# Altium schematic sheet JTAG.SchDoc
size A3
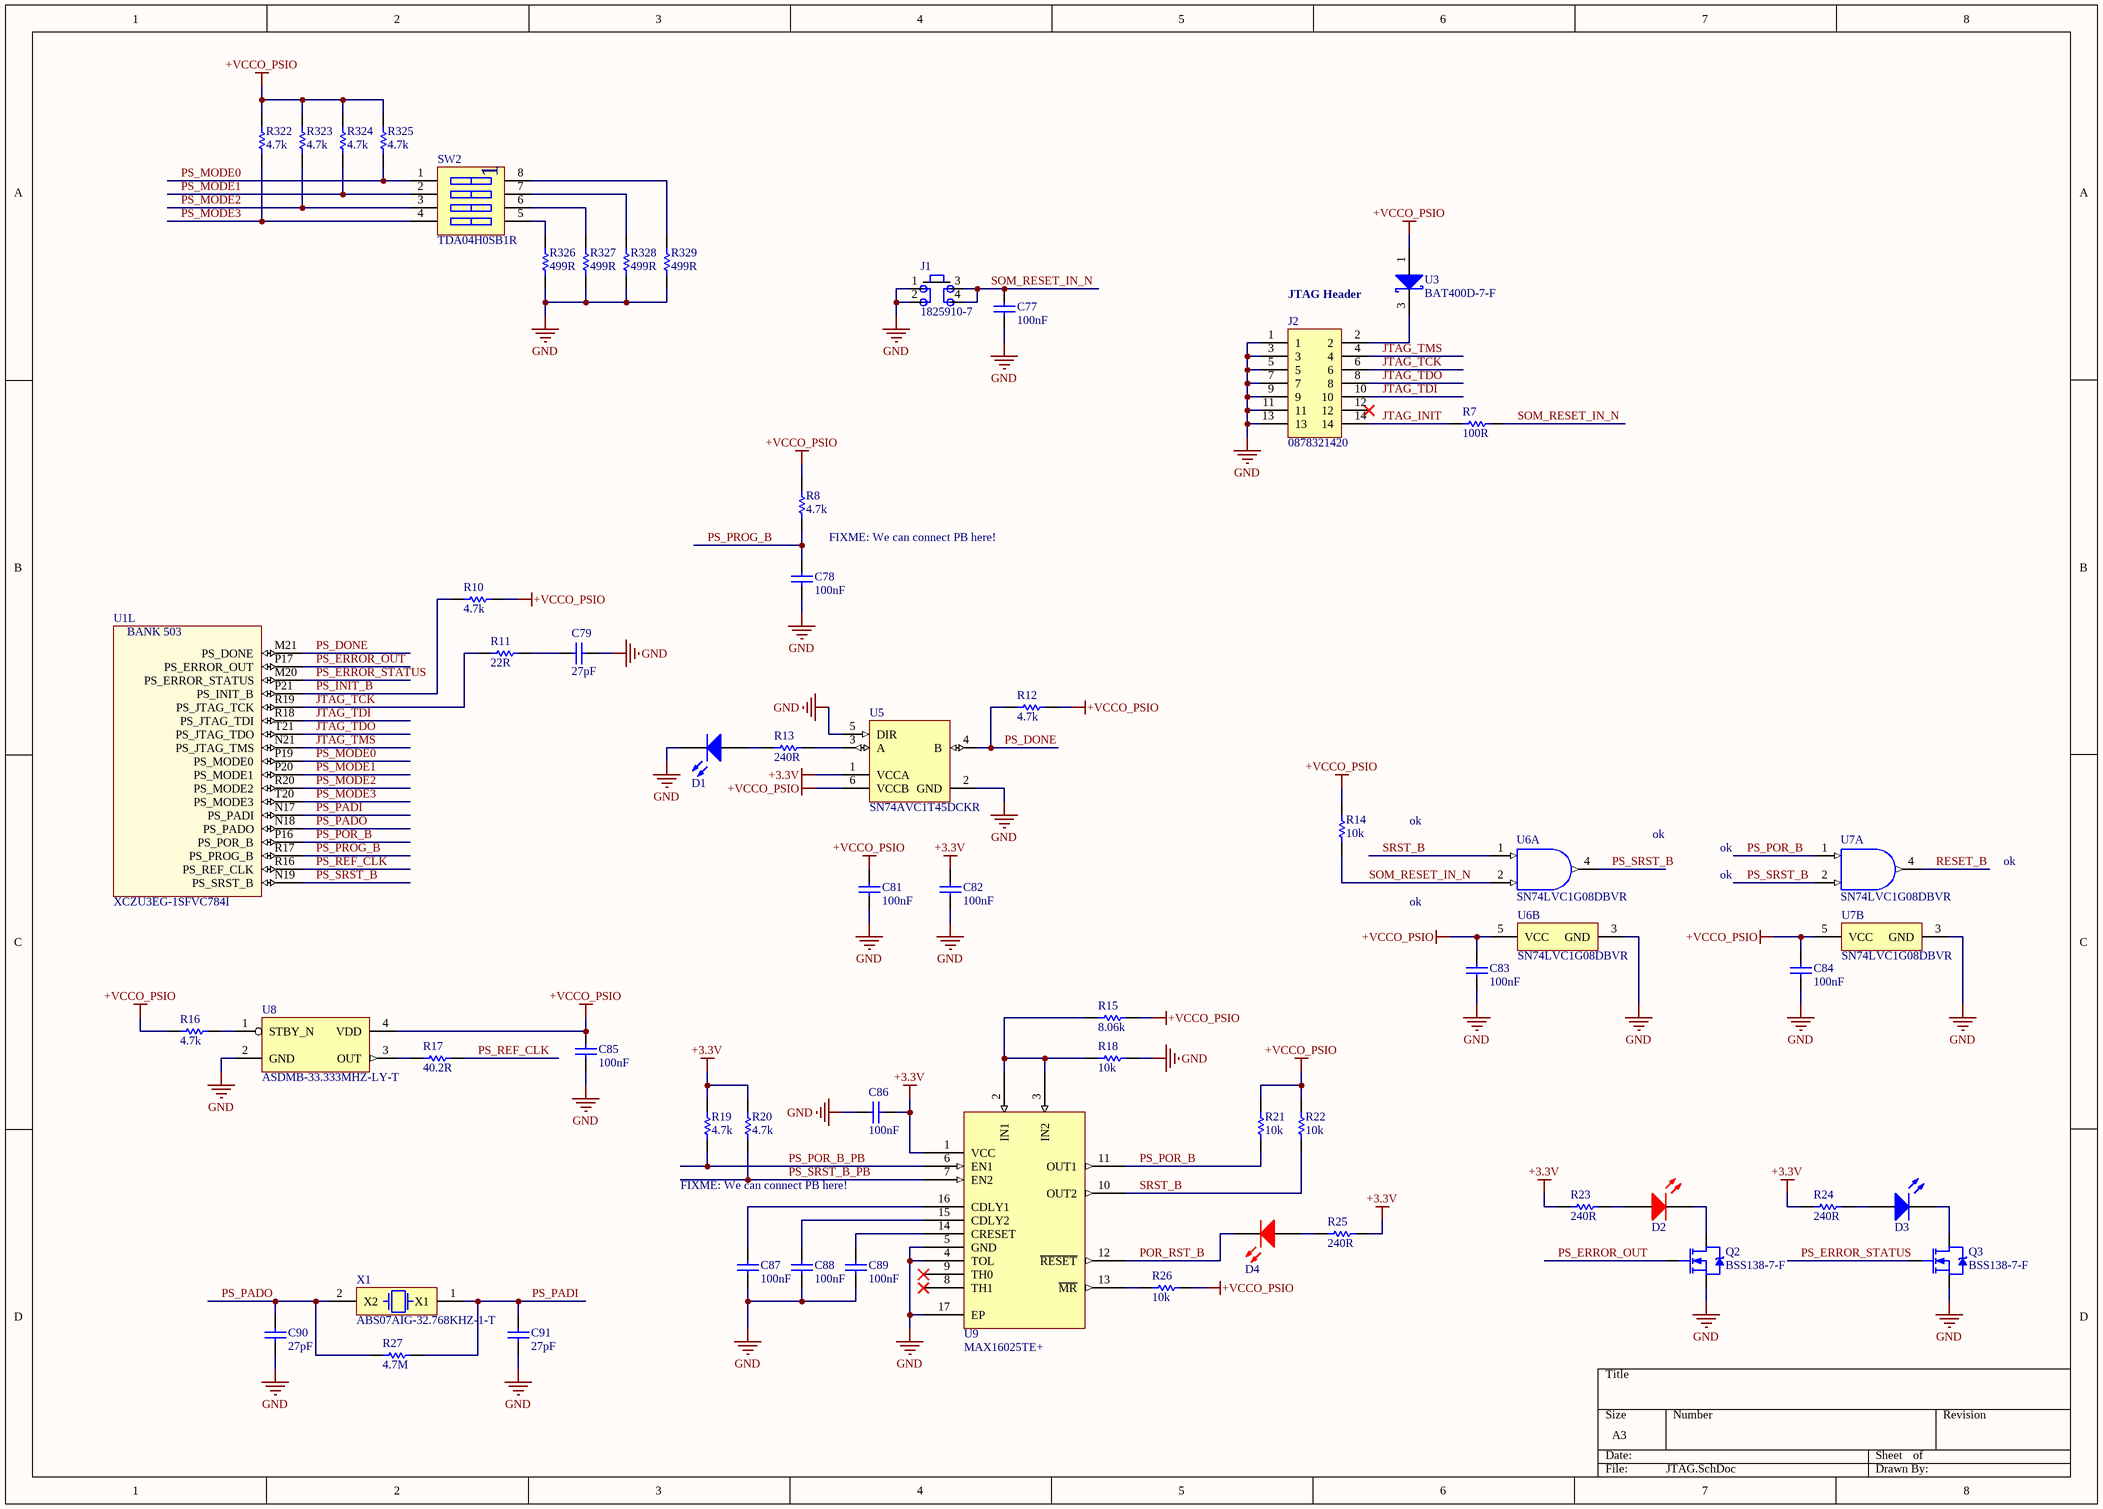
[diagram p0: JTAG.SchDoc]

## Parts
C77  100nF  [CAPC1005L_0402]
C78  100nF  [CAPC1005L_0402]
C79  27pF  [CAPC1005L_0402]
C81  100nF  [CAPC1005L_0402]
C82  100nF  [CAPC1005L_0402]
C83  100nF  [CAPC1005L_0402]
C84  100nF  [CAPC1005L_0402]
C85  100nF  [CAPC1005L_0402]
C86  100nF  [CAPC1005L_0402]
C87  100nF  [CAPC1005L_0402]
C88  100nF  [CAPC1005L_0402]
C89  100nF  [CAPC1005L_0402]
C90  27pF  [CAPC1005L_0402]
C91  27pF  [CAPC1005L_0402]
D1  LED0603BLUE  [LED0603BLUE]  (value not drawn)
D2  LED0603RED  [LED0603RED]  (value not drawn)
D3  LED0603GREEN  [LED0603GREEN]  (value not drawn)
D4  LED0603RED  [LED0603RED]  (value not drawn)
J1  1825910-7  [PB_1825910-7]
J2  0878321420  [0878321420]
Q2  BSS138-7-F  [DIODES_SOT23]
Q3  BSS138-7-F  [DIODES_SOT23]
R7  value 100R  [RESC1005L_0402]  (hidden comment: RES0402_100R_0W1_1T)
R8  value 4.7k  [RESC1005L_0402]  (hidden comment: RES0402_4K7_0W1_1T)
R10  value 4.7k  [RESC1005L_0402]  (hidden comment: RES0402_4K7_0W1_1T)
R11  value 22R  [RESC1005L_0402]  (hidden comment: RES0402_22R_0W1_1T)
R12  value 4.7k  [RESC1005L_0402]  (hidden comment: RES0402_4K7_0W1_1T)
R13  value 240R  [RESC1005L_0402]  (hidden comment: RES0402_240R_0W1_1T)
R14  value 10k  [RESC1005L_0402]  (hidden comment: RES0402_10K_0W1_05T)
R15  value 8.06k  [RESC1005L_0402]  (hidden comment: RES0402_8K06_0W1_1T)
R16  value 4.7k  [RESC1005L_0402]  (hidden comment: RES0402_4K7_0W1_1T)
R17  value 40.2R  [RESC1005L_0402]  (hidden comment: RES0402_40R2_0W1_1T)
R18  value 10k  [RESC1005L_0402]  (hidden comment: RES0402_10K_0W1_05T)
R19  value 4.7k  [RESC1005L_0402]  (hidden comment: RES0402_4K7_0W1_1T)
R20  value 4.7k  [RESC1005L_0402]  (hidden comment: RES0402_4K7_0W1_1T)
R21  value 10k  [RESC1005L_0402]  (hidden comment: RES0402_10K_0W1_05T)
R22  value 10k  [RESC1005L_0402]  (hidden comment: RES0402_10K_0W1_05T)
R23  value 240R  [RESC1005L_0402]  (hidden comment: RES0402_240R_0W1_1T)
R24  value 240R  [RESC1005L_0402]  (hidden comment: RES0402_240R_0W1_1T)
R25  value 240R  [RESC1005L_0402]  (hidden comment: RES0402_240R_0W1_1T)
R26  value 10k  [RESC1005L_0402]  (hidden comment: RES0402_10K_0W1_05T)
R27  value 4.7M  [RESC1005L_0402]  (hidden comment: RES0402_4M7_0W1_5T)
R322  value 4.7k  [RESC1005L_0402]  (hidden comment: RES0402_4K7_0W1_1T)
R323  value 4.7k  [RESC1005L_0402]  (hidden comment: RES0402_4K7_0W1_1T)
R324  value 4.7k  [RESC1005L_0402]  (hidden comment: RES0402_4K7_0W1_1T)
R325  value 4.7k  [RESC1005L_0402]  (hidden comment: RES0402_4K7_0W1_1T)
R326  value 499R  [RESC1005L_0402]  (hidden comment: RES0402_499R_0W1_1T)
R327  value 499R  [RESC1005L_0402]  (hidden comment: RES0402_499R_0W1_1T)
R328  value 499R  [RESC1005L_0402]  (hidden comment: RES0402_499R_0W1_1T)
R329  value 499R  [RESC1005L_0402]  (hidden comment: RES0402_499R_0W1_1T)
SW2  TDA04H0SB1R  [4POS_DIP_SWITCH]
U1  XCZU3EG-1SFVC784I  [BGA784x28]  (part L of 22)
U3  BAT400D-7-F  [BAT400D-7-F _SOT23]
U5  SN74AVC1T45DCKR  [DCK0006A_N]
U6  SN74LVC1G08DBVR  [DBV0005A_N]  (parts A,B of 2)
U7  SN74LVC1G08DBVR  [DBV0005A_N]  (parts A,B of 2)
U8  ASDMB-33.333MHZ-LY-T  [ASDMB]
U9  MAX16025TE+  [T1644+4_L]
X1  ABS07AIG-32.768KHZ-1-T  [ABS07]

## Nets
+3.3V: C82.1 C86.1 R19.1 R20.1 R23.1 R24.1 R25.2 U5.1(VCCA) U9.1(VCC)
+VCCO_PSIO: C81.1 C83.1 C84.1 C85.1 R8.1 R10.2 R12.2 R14.1 R15.2 R16.1 R21.1 R22.1 R26.1 R322.2 R323.2 R324.2 R325.2 U3.1(A) U5.6(VCCB) U6.5(VCC) U7.5(VCC) U8.4(VDD)
GND: C77.1 C78.2 C79.2 C81.2 C82.2 C83.2 C84.2 C85.2 C86.2 C87.2 C88.2 C89.2 C90.2 C91.2 D1.2(K) J1.1 J1.2 J2.1 J2.3 J2.5 J2.7 J2.9 J2.11 J2.13 Q2.S Q3.S R18.2 R326.2 R327.2 R328.2 R329.2 U5.2(GND) U5.5(DIR) U6.3(GND) U7.3(GND) U8.2(GND) U9.4(TOL) U9.5(GND) U9.17(EP)
JTAG_INIT: J2.14 R7.1
JTAG_TCK: J2.6 R11.1 U1.R19(PS_JTAG_TCK)
JTAG_TDI: J2.10 U1.R18(PS_JTAG_TDI)
JTAG_TDO: J2.8 U1.T21(PS_JTAG_TDO)
JTAG_TMS: J2.4 U1.N21(PS_JTAG_TMS)
POR_RST_B: D4.2(K) U9.12(~{RESET})
PS_DONE: R12.1 U1.M21(PS_DONE) U5.4(B)
PS_ERROR_OUT: Q2.G U1.P17(PS_ERROR_OUT)
PS_ERROR_STATUS: Q3.G U1.M20(PS_ERROR_STATUS)
PS_INIT_B: R10.1 U1.P21(PS_INIT_B)
PS_MODE0: R325.1 SW2.1 U1.P19(PS_MODE0)
PS_MODE1: R324.1 SW2.2 U1.P20(PS_MODE1)
PS_MODE2: R323.1 SW2.3 U1.R20(PS_MODE2)
PS_MODE3: R322.1 SW2.4 U1.T20(PS_MODE3)
PS_PADI: C91.1 R27.2 U1.N17(PS_PADI) X1.1(X1)
PS_PADO: C90.1 R27.1 U1.N18(PS_PADO) X1.2(X2)
PS_POR_B: R21.2 U1.P16(PS_POR_B) U7.1(A) U9.11(OUT1)
PS_POR_B_PB: R19.2 U9.6(EN1)
PS_PROG_B: C78.1 R8.2 U1.R17(PS_PROG_B)
PS_REF_CLK: R17.2 U1.R16(PS_REF_CLK)
PS_SRST_B: U1.N19(PS_SRST_B) U6.4(Y) U7.2(B)
PS_SRST_B_PB: R20.2 U9.7(EN2)
RESET_B: U7.4(Y)
SOM_RESET_IN_N: C77.2 J1.3 J1.4 R7.2 R14.2 U6.2(B)
SRST_B: R22.2 U6.1(A) U9.10(OUT2)
NetC79_1: C79.1 R11.2
NetC87_1: C87.1 U9.16(CDLY1)
NetC88_1: C88.1 U9.15(CDLY2)
NetC89_1: C89.1 U9.14(CRESET)
NetD1_1: D1.1(A) R13.1
NetD2_1: D2.1(A) R23.2
NetD2_2: D2.2(K) Q2.D
NetD3_1: D3.1(A) R24.2
NetD3_2: D3.2(K) Q3.D
NetD4_1: D4.1(A) R25.1
NetJ2_2: J2.2 U3.3(K)
NetR13_2: R13.2 U5.3(A)
NetR15_1: R15.1 R18.1 U9.2(IN1) U9.3(IN2)
NetR16_2: R16.2 U8.1(STBY_N)
NetR17_1: R17.1 U8.3(OUT)
NetR26_2: R26.2 U9.13(~{MR})
NetR326_1: R326.1 SW2.5
NetR327_1: R327.1 SW2.6
NetR328_1: R328.1 SW2.7
NetR329_1: R329.1 SW2.8

Not connected (* = marked no-connect by the designer): J2 12*; U9 8(TH1)* 9(TH0)*

## Notes on the sheet
- JTAG Header
- FIXME: We can connect PB here!
- ok
- (in symbol XCZU3EG-1SFVC784I, part L) BANK 503

## Library data of the parts
C77 C78 C81-C89 = CAPCER0402X7R100N25V_10T: CAP CER 0.1UF 25V X7R 0402; Manufacturer 1: Murata Electronics North America; Manufacturer Part Number 1: GRM155R71E104KE14D; Tolerance: 10%; Package: 0402; ComponentLink1Description: Datasheet; Value: 100nF; Voltage: 25V; Temperature Coefficient: X7R; Supplier 1: Digi-Key; Supplier Part Number 1: 490-10698-1-ND; Operating Temperature: -55°C ~ 125°C
C79 C90 C91 = CAPCER0402C0G27P50V_5T: CAP CER 27PF 50V C0G/NP0 0402; Manufacturer 1: Murata Electronics North America; Manufacturer Part Number 1: GRM1555C1H270JA01D; Tolerance: 5%; Package: 0402; ComponentLink1Description: Datasheet; Value: 27pF; Voltage: 50V; Temperature Coefficient: C0G/NP0; Supplier 1: Digi-Key; Supplier Part Number 1: 490-5869-1-ND; Operating Temperature: -55°C ~ 125°C
D1 = LED0603BLUE: LED BLUE DIFFUSED 0603 SMD; Manufacturer 1: Broadcom Limited; Manufacturer Part Number 1: HSMR-C191; Voltage - Forward (Vf) (Typ): 3.4V; Current - Test: 20mA; Package: 0603; Supplier 1: Digi-Key; Supplier Part Number 1: 516-2523-1-ND; ComponentLink1Description: Datasheet; ComponentLink1URL: C:\Users\Public\Documents\Altium\AD16\Library\PDF\AV02-0592EN0.pdf
D2 D4 = LED0603RED: LED RED DIFFUSED 0603 SMD; Manufacturer 1: Broadcom Limited; Manufacturer Part Number 1: HSMH-C191; Voltage - Forward (Vf) (Typ): 1.8V; Current - Test: 20mA; Package: 0603; Supplier 1: Digi-Key; Supplier Part Number 1: 516-3067-1-ND; ComponentLink1Description: Datasheet; ComponentLink1URL: C:\Users\Public\Documents\Altium\AD16\Library\PDF\AV02-0592EN0.pdf
D3 = LED0603GREEN: LED GREEN DIFFUSED 0603 SMD; Manufacturer 1: Broadcom Limited; Manufacturer Part Number 1: HSMM-C190; Voltage - Forward (Vf) (Typ): 3.3V; Current - Test: 20mA; Package: 0603; Supplier 1: Digi-Key; Supplier Part Number 1: 516-2833-1-ND; ComponentLink1Description: Datasheet; ComponentLink1URL: C:\Users\Public\Documents\Altium\AD16\Library\PDF\AV02-0592EN0.pdf
J1 = 1825910-7: SWITCH TACTILE SPST-NO 0.05A 24V; Manufacturer 1: TE Connectivity ALCOSWITCH Switches; Opearating Temperature: -35°C ~ 85°C; ComponentLink1Description: Drawing; ComponentLink1URL: C:\Users\Public\Documents\Altium\AD16\Library\PDF\ENG_CD_1825910_C10.pdf; Supplier 1: Digi-Key; Manufacturer Part Number 1: 1825910-7; Supplier Part Number 1: 450-1804-ND
J2 = 0878321420: CONN HEADER 14POS 2MM VERT SMD; Manufacturer 1: Molex, LLC; Number of Positions: 14; Supplier 1: Digi-Key; Manufacturer Part Number 1: 0878321420; Pitch: 2mm; Number of Rows: 2; ComponentLink1URL: C:\Users\Public\Documents\Altium\AD16\Library\PDF\878322620_sd.pdf; ComponentLink1Description: Drawing; Supplier Part Number 1: 952-1809-ND
Q2 Q3 = BSS138-7-F: MOSFET N-CH 50V 200MA SOT23-3; Manufacturer 1: Diodes Incorporated; ComponentLink1Description: Datasheet; ComponentLink1URL: C:\Users\Public\Documents\Altium\AD16\Library\PDF\ds30144.pdf; Supplier 1: Digi-Key; Supplier Part Number 1: BSS138-FDICT-ND; Manufacturer Part Number 1: BSS138-7-F; Operating Temperature: -55°C ~ 150°C (TJ)
R7 = RES0402_100R_0W1_1T: RES SMD 100 OHM 1% 1/10W 0402; Manufacturer 1: Panasonic Electronic Components; Manufacturer Part Number 1: ERJ-2RKF1000X; Package: 0402; ComponentLink1Description: Datasheet; Power: 1/10W; Tolerance: 1%; Supplier 1: Digi-Key; Supplier Part Number 1: P100LCT-ND
R8 R10 R12 R16 R19 R20 R322-R325 = RES0402_4K7_0W1_1T: RES SMD 4.7K OHM 1% 1/10W 0402; Manufacturer 1: Panasonic Electronic Components; Manufacturer Part Number 1: ERJ-2RKF4701X; Package: 0402; ComponentLink1Description: Datasheet; Power: 1/10W; Tolerance: 1%; Supplier 1: Digi-Key; Supplier Part Number 1: P4.70KLCT-ND
R11 = RES0402_22R_0W1_1T: RES SMD 22 OHM 1% 1/10W 0402; Manufacturer 1: Panasonic Electronic Components; Manufacturer Part Number 1: ERJ-2RKF22R0X; Package: 0402; ComponentLink1Description: Datasheet; Power: 1/10W; Tolerance: 1%; Supplier 1: Digi-Key; Supplier Part Number 1: P22.0LCT-ND
R13 R23-R25 = RES0402_240R_0W1_1T: RES SMD 240 OHM 1% 1/10W 0402; Manufacturer 1: Panasonic Electronic Components; Manufacturer Part Number 1: ERJ-2RKF2400X; Package: 0402; ComponentLink1Description: Datasheet; Power: 1/10W; Tolerance: 1%; Supplier 1: Digi-Key; Supplier Part Number 1: P240LCT-ND
R14 R18 R21 R22 R26 = RES0402_10K_0W1_05T: RES SMD 10K OHM 0.5% 1/16W 0402; Manufacturer 1: Panasonic Electronic Components; Manufacturer Part Number 1: ERJ-2RHD1002X; Package: 0402; ComponentLink1Description: Datasheet; Power: 1/16W; Tolerance: 0.5%; Supplier 1: Digi-Key; Supplier Part Number 1: P15984CT-ND
R15 = RES0402_8K06_0W1_1T: RES SMD 8.06K OHM 1% 1/10W 0402; Manufacturer 1: Panasonic Electronic Components; Manufacturer Part Number 1: ERJ-2RKF8061X; Package: 0402; ComponentLink1Description: Datasheet; Power: 1/10W; Tolerance: 1%; Supplier 1: Digi-Key; Supplier Part Number 1: P8.06KLCT-ND
R17 = RES0402_40R2_0W1_1T: RES SMD 40.2 OHM 1% 1/10W 0402; Manufacturer 1: Panasonic Electronic Components; Manufacturer Part Number 1: ERJ-2RKF40R2X; Package: 0402; ComponentLink1Description: Datasheet; Power: 1/10W; Tolerance: 1%; Supplier 1: Digi-Key; Supplier Part Number 1: P40.2LCT-ND
R27 = RES0402_4M7_0W1_5T: RES SMD 4.7M OHM 5% 1/16W 0402; Manufacturer 1: Vishay Dale; Manufacturer Part Number 1: CRCW04024M70JNED; Power: 1/10W; Package: 0402; ComponentLink1Description: Datasheet; Tolerance: 5%; Supplier 1: Digi-Key; Supplier Part Number 1: 541-4.7MJCT-ND
R326-R329 = RES0402_499R_0W1_1T: RES SMD 499 OHM 1% 1/16W 0402; Manufacturer 1: Vishay Dale; Manufacturer Part Number 1: CRCW0402499RFKTD; Power: 1/10W; Package: 0402; ComponentLink1Description: Datasheet; Tolerance: 1%; Supplier 1: Digi-Key; Supplier Part Number 1: 541-2962-1-ND
SW2 = TDA04H0SB1R: SWITCH SLIDE DIP SPST 25MA 24V; Manufacturer 1: C&K; Pitch: 1.27mm; Number of Contact: 4; Supplier 1: Digi-Key; Manufacturer Part Number 1: TDA04H0SB1R; ComponentLink1URL: C:\Users\Public\Documents\Altium\AD16\Library\PDF\tda.pdf; ComponentLink1Description: Drawing; Supplier Part Number 1: CKN9502CT-ND
U1 = XCZU3EG-1SFVC784I: IC FPGA 252 I/O 784FCBGA - XILINX ZYNQ ULTRASCALE+; Manufacturer 1: Xilinx Inc.; Package: SFVC784; ComponentLink1Description: Datasheet; Supplier 1: Digi-Key; Supplier Part Number 1: XCZU3EG-1SFVC784I-ND; Manufacturer Part Number 1: XCZU3EG-1SFVC784I
U3 = BAT400D-7-F: DIODE SCHOTTKY 40V 500MA SOT23-3; Manufacturer 1: Diodes Incorporated; ComponentLink1Description: Datasheet; ComponentLink1URL: C:\Users\Public\Documents\Altium\AD16\Library\PDF\ds30182.pdf; Supplier 1: Digi-Key; Supplier Part Number 1: BAT400D-FDICT-ND; Manufacturer Part Number 1: BAT400D-7-F; Operating Temperature: -40°C ~ 125°C
U5 = SN74AVC1T45DCKR: Single-Bit Dual-Supply Bus Transceiver with Configurable Voltage Translation and 3-State Outputs, DCK0006A, LARGE T&R; Manufacturer 1: Texas Instruments; VCC(Min)(V): 1.2; VCC(Max)(V): 3.6; Output Type: CMOS; Logic: True; ICC @ Nom Voltage(Max)(mA): 0.0009; Bits(#): 1; F @ Nom Voltage(Max)(Mhz): 100; Rating: Catalog; Technology Family: AVC; Voltage(Nom)(V): 1.2,1.5,1.8,2.5,3.3; Schmitt Trigger: No; Output Drive (IOL/IOH)(Max)(mA): 12/-12; Sub-Family: Dual Supply Translator; 3-State Output: Yes; tpd @ Nom Voltage(Max)(ns): 2.9,5.6,5.2,4.2,3.8; DatasheetVersion: SCES530H; PackageReference: DCK0006A; Supplier 2: Mouser; Supplier Part Number 2: 595-SN74AVC1T45DCKR; Supplier 1: Digi-Key; Supplier Part Number 1: 296-17992-2-ND; Supplier 3: Digi-Key; Supplier Part Number 3: 296-17992-1-ND; Supplier 4: Digi-Key; Supplier Part Number 4: 296-17992-6-ND; Generic Part Number: SN74AVC1T45; Input Type: CMOS; Operating Temperature Range(C): -40 to 85; Manufacturer Part Number 1: SN74AVC1T45DCKR; ComponentLink1Description: Manufacturer URL; ComponentLink1URL: C:\Users\Public\Documents\Altium\AD16\Library\PDF\sn74avc1t45.pdf
U6 U7 = SN74LVC1G08DBVR: Single 2-Input Positive-AND Gate, DBV0005A, LARGE T&R; Manufacturer 1: Texas Instruments; VCC(Min)(V): 1.65; VCC(Max)(V): 5.5; Output Type: CMOS; ICC @ Nom Voltage(Max)(mA): 0.01; Input Type: CMOS/TTL; Bits(#): 1; F @ Nom Voltage(Max)(Mhz): 150; Rating: Catalog; Technology Family: LVC; Voltage(Nom)(V): 1.8,2.5,3.3,5; Schmitt Trigger: No; Output Drive (IOL/IOH)(Max)(mA): 32/-32; tpd @ Nom Voltage(Max)(ns): 4.5,6,4,5; Logic: True; Gate Type: AND; DatasheetVersion: SCES217Y; PackageReference: DBV0005A; Supplier 2: Mouser; Supplier Part Number 2: 595-SN74LVC1G08DBVR; Supplier 1: Digi-Key; Supplier Part Number 1: 296-11601-2-ND; Supplier 3: Digi-Key; Supplier Part Number 3: 296-11601-1-ND; Supplier 4: Digi-Key; Supplier Part Number 4: 296-11601-6-ND; Generic Part Number: SN74LVC1G08; Operating Temperature: -40°C ~ 125°C; Sub-Family: AND Gate; 3-State Output: No; Manufacturer Part Number 1: SN74LVC1G08DBVR; ComponentLink1Description: Manufacturer URL; ComponentLink1URL: C:\Users\Public\Documents\Altium\AD16\Library\PDF\sn74lvc1g08.pdf
U8 = ASDMB-33.333MHZ-LY-T: OSC MEMS 33.333MHZ CMOS SMD; Manufacturer 1: Abracon LLC; Frequency Stability: ±10ppm; ComponentLink1Description: Datasheet; ComponentLink1URL: C:\Users\Public\Documents\Altium\AD16\Library\PDF\ASDMB.pdf; Supplier 1: Digi-Key; Supplier Part Number 1: 535-11196-1-ND; Manufacturer Part Number 1: ASDMB-33.333MHZ-LY-T; Operating Temperature: -40°C ~ 85°C; Frequency: 33.333MHz
U9 = MAX16025TE+: IC SUPERVISORY CIRC DL 16TQFN; Manufacturer 1: Maxim Integrated; ComponentLink1Description: Datasheet; ComponentLink1URL: C:\Users\Public\Documents\Altium\AD16\Library\PDF\MAX16025-MAX16030.pdf; Supplier 1: Digi-Key; Supplier Part Number 1: MAX16025TE+-ND; Manufacturer Part Number 1: MAX16025TE+; Operating Temperature: -40°C ~ 125°C (TA)
X1 = ABS07AIG-32.768KHZ-1-T: CRYSTAL 32.768KHZ 12.5PF SMD; Manufacturer 1: Abracon LLC; Frequency Tolerance: ±10ppm; ComponentLink1Description: Datasheet; ComponentLink1URL: C:\Users\Public\Documents\Altium\AD16\Library\PDF\ABS07.pdf; Supplier 1: Digi-Key; Supplier Part Number 1: 535-13352-1-ND; Manufacturer Part Number 1: ABS07AIG-32.768KHZ-1-T; Operating Temperature: -40°C ~ 125°C; Load Capacitance: 12.5pF; Frequency: 32.768kHz